# Altium schematic sheet Balance Board.SchDoc
size B
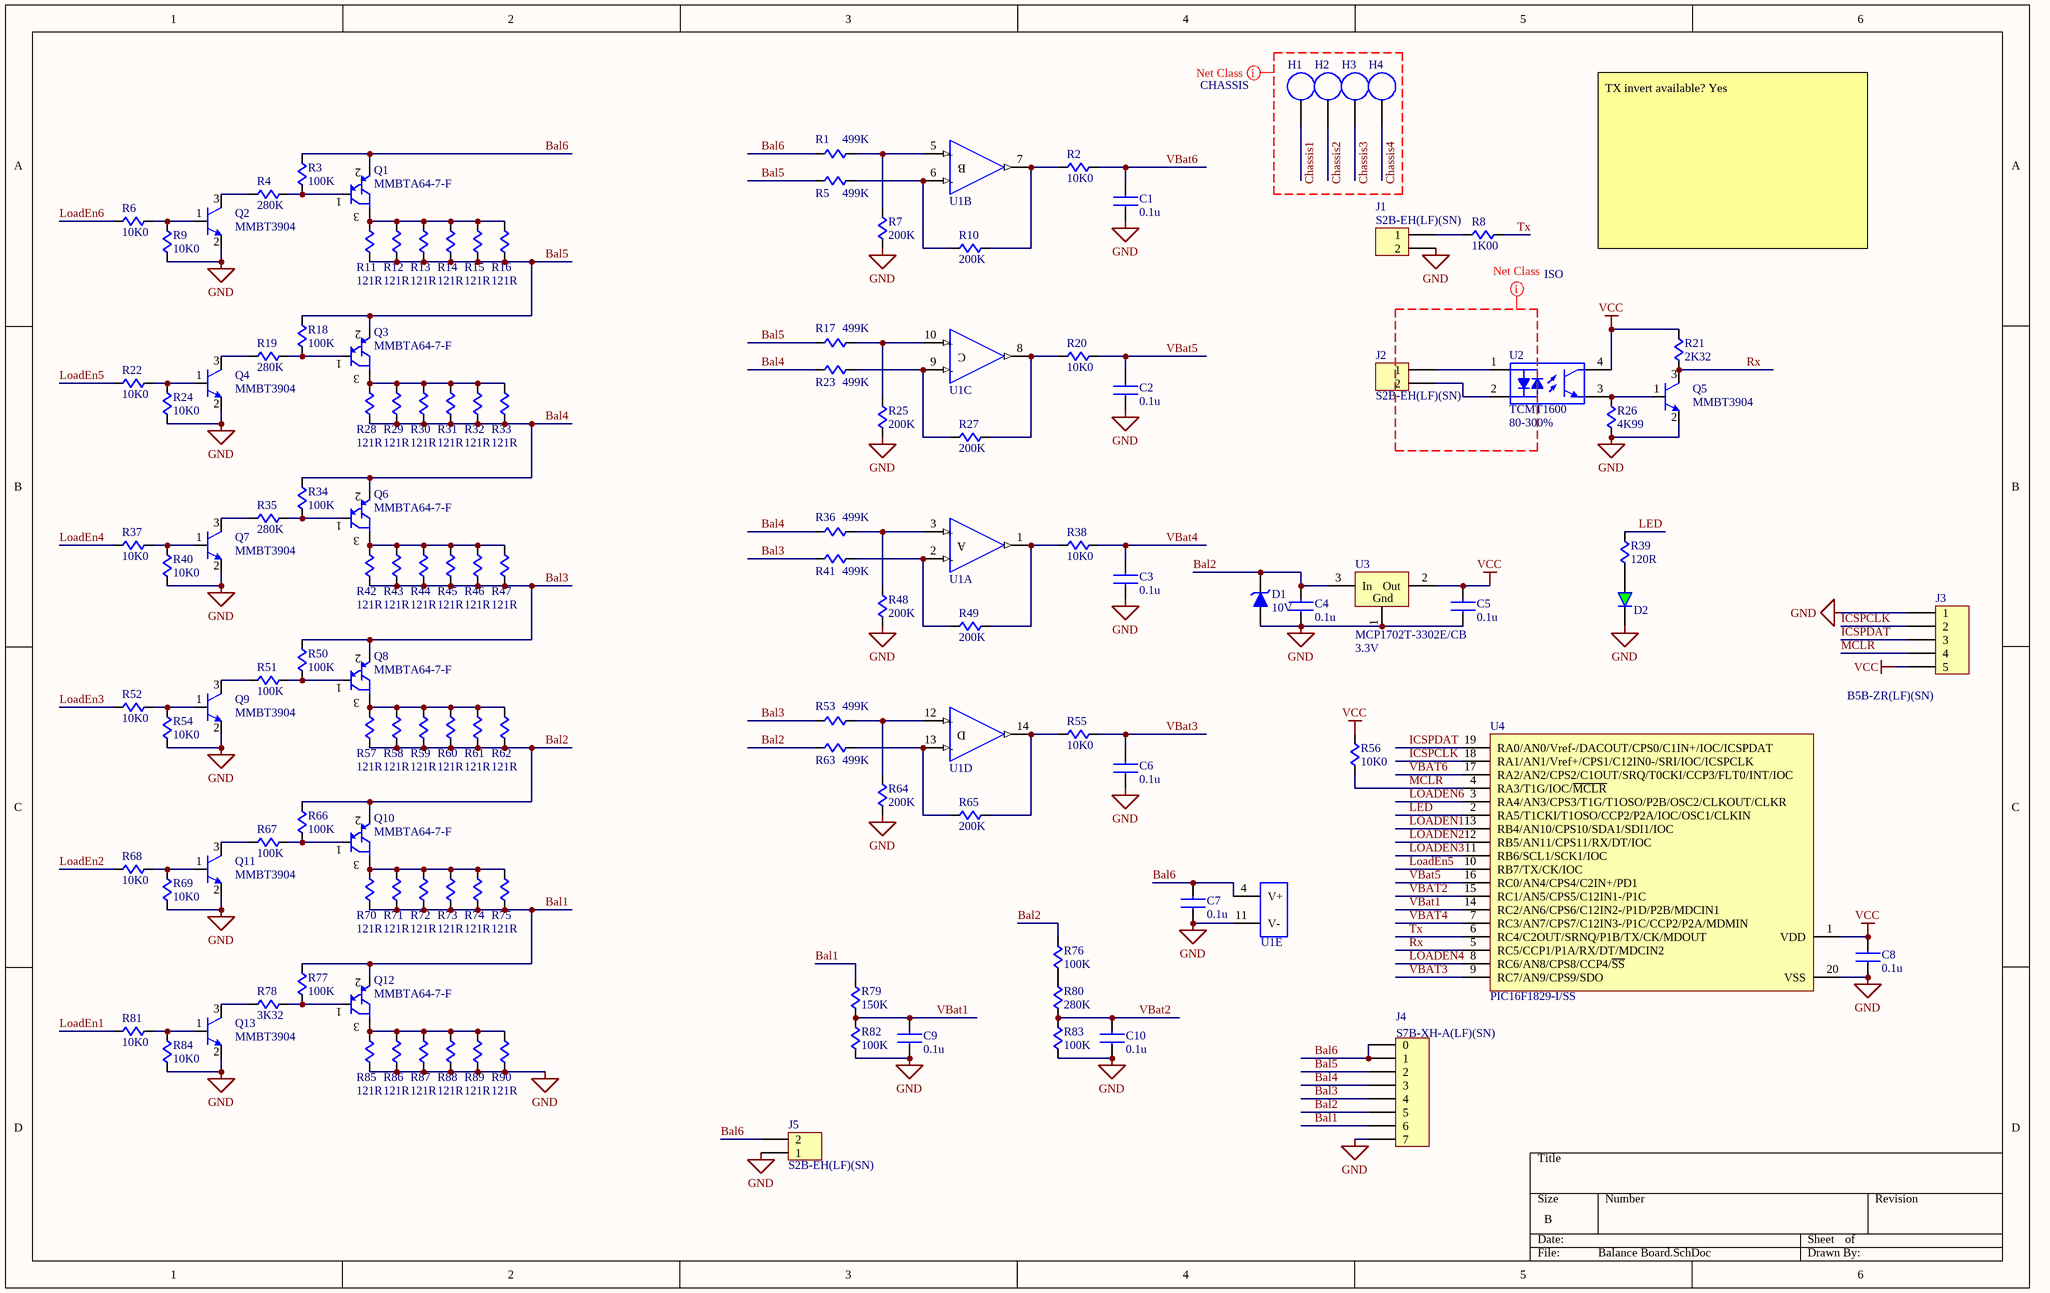
[diagram p0: Balance Board.SchDoc]

## Parts
C1  value 0.1u  [CAPC1608N-0603]  (hidden comment: Cap Ceramic 0.1u 25V X7R 0603)
C2  value 0.1u  [CAPC1608N-0603]  (hidden comment: Cap Ceramic 0.1u 25V X7R 0603)
C3  value 0.1u  [CAPC1608N-0603]  (hidden comment: Cap Ceramic 0.1u 25V X7R 0603)
C4  value 0.1u  [CAPC1608N-0603]  (hidden comment: Cap Ceramic 0.1u 25V X7R 0603)
C5  value 0.1u  [CAPC1608N-0603]  (hidden comment: Cap Ceramic 0.1u 25V X7R 0603)
C6  value 0.1u  [CAPC1608N-0603]  (hidden comment: Cap Ceramic 0.1u 25V X7R 0603)
C7  value 0.1u  [CAPC1608N-0603]  (hidden comment: Cap Ceramic 0.1u 50V X7R 0603)
C8  value 0.1u  [CAPC1608N-0603]  (hidden comment: Cap Ceramic 0.1u 25V X7R 0603)
C9  value 0.1u  [CAPC1608N-0603]  (hidden comment: Cap Ceramic 0.1u 25V X7R 0603)
C10  value 0.1u  [CAPC1608N-0603]  (hidden comment: Cap Ceramic 0.1u 25V X7R 0603)
D1  value 10V  [SOD-123]  (hidden comment: Diode Zener 10V 0.5W SOD-123)
D2  LED Green 160° 0603  [CAPC1608N-0603]  (value not drawn)
H1  Mounting Hole  [HOLE MOUNTING 3MM]  (value not drawn)  (no BOM)
H2  Mounting Hole  [HOLE MOUNTING 3MM]  (value not drawn)  (no BOM)
H3  Mounting Hole  [HOLE MOUNTING 3MM]  (value not drawn)  (no BOM)
H4  Mounting Hole  [HOLE MOUNTING 3MM]  (value not drawn)  (no BOM)
J1  value S2B-EH(LF)(SN)  [S2B-EH]  (hidden comment: Conn Header 2.5mm RA 2-Pos EH)
J2  value S2B-EH(LF)(SN)  [S2B-EH]  (hidden comment: Conn Header 2.5mm RA 2-Pos EH)
J3  value B5B-ZR(LF)(SN)  [B5B-ZR]  (hidden comment: Conn Header 1.5mm Vert 5-Pos ZH)
J4  value S7B-XH-A(LF)(SN)  [S7B-XH&78B-XH-REV]  (hidden comment: Conn Header 2.5mm RA 7-Pos XH)
J5  value S2B-EH(LF)(SN)  [S2B-EH]  (hidden comment: Conn Header 2.5mm RA 2-Pos EH)
Q1  value MMBTA64-7-F  [SOT23-3N]  (hidden comment: Tran PNP Darl 30V 500mA SOT-23)
Q2  value MMBT3904  [SOT23-3N]  (hidden comment: Tran NPN 40V 200mA SOT-23)
Q3  value MMBTA64-7-F  [SOT23-3N]  (hidden comment: Tran PNP Darl 30V 500mA SOT-23)
Q4  value MMBT3904  [SOT23-3N]  (hidden comment: Tran NPN 40V 200mA SOT-23)
Q5  value MMBT3904  [SOT23-3N]  (hidden comment: Tran NPN 40V 200mA SOT-23)
Q6  value MMBTA64-7-F  [SOT23-3N]  (hidden comment: Tran PNP Darl 30V 500mA SOT-23)
Q7  value MMBT3904  [SOT23-3N]  (hidden comment: Tran NPN 40V 200mA SOT-23)
Q8  value MMBTA64-7-F  [SOT23-3N]  (hidden comment: Tran PNP Darl 30V 500mA SOT-23)
Q9  value MMBT3904  [SOT23-3N]  (hidden comment: Tran NPN 40V 200mA SOT-23)
Q10  value MMBTA64-7-F  [SOT23-3N]  (hidden comment: Tran PNP Darl 30V 500mA SOT-23)
Q11  value MMBT3904  [SOT23-3N]  (hidden comment: Tran NPN 40V 200mA SOT-23)
Q12  value MMBTA64-7-F  [SOT23-3N]  (hidden comment: Tran PNP Darl 30V 500mA SOT-23)
Q13  value MMBT3904  [SOT23-3N]  (hidden comment: Tran NPN 40V 200mA SOT-23)
R1  value 499K  [RESC1608N-0603]  (hidden comment: Res 499K 1/10W 1% 0603)
R2  value 10K0  [RESC1608N-0603]  (hidden comment: Res 10.0K 1/10W 1% 0603)
R3  value 100K  [RESC1608N-0603]  (hidden comment: Res 100K 1/10W 1% 0603)
R4  value 280K  [RESC1608N-0603]  (hidden comment: Res 280K 1/10W 1% 0603)
R5  value 499K  [RESC1608N-0603]  (hidden comment: Res 499K 1/10W 1% 0603)
R6  value 10K0  [RESC1608N-0603]  (hidden comment: Res 10.0K 1/10W 1% 0603)
R7  value 200K  [RESC1608N-0603]  (hidden comment: Res 200K 1/10W 1% 0603)
R8  value 1K00  [RESC1608N-0603]  (hidden comment: Res 1.00K 1/10W 1% 0603)
R9  value 10K0  [RESC1608N-0603]  (hidden comment: Res 10.0K 1/10W 1% 0603)
R10  value 200K  [RESC1608N-0603]  (hidden comment: Res 200K 1/10W 1% 0603)
R11  value 121R  [RESC3216N-1206]  (hidden comment: Res 121R 1/4W 1% 1206)
R12  value 121R  [RESC3216N-1206]  (hidden comment: Res 121R 1/4W 1% 1206)
R13  value 121R  [RESC3216N-1206]  (hidden comment: Res 121R 1/4W 1% 1206)
R14  value 121R  [RESC3216N-1206]  (hidden comment: Res 121R 1/4W 1% 1206)
R15  value 121R  [RESC3216N-1206]  (hidden comment: Res 121R 1/4W 1% 1206)
R16  value 121R  [RESC3216N-1206]  (hidden comment: Res 121R 1/4W 1% 1206)
R17  value 499K  [RESC1608N-0603]  (hidden comment: Res 499K 1/10W 1% 0603)
R18  value 100K  [RESC1608N-0603]  (hidden comment: Res 100K 1/10W 1% 0603)
R19  value 280K  [RESC1608N-0603]  (hidden comment: Res 280K 1/10W 1% 0603)
R20  value 10K0  [RESC1608N-0603]  (hidden comment: Res 10.0K 1/10W 1% 0603)
R21  value 2K32  [RESC1608N-0603]  (hidden comment: Res 2.32K 1/10W 1% 0603)
R22  value 10K0  [RESC1608N-0603]  (hidden comment: Res 10.0K 1/10W 1% 0603)
R23  value 499K  [RESC1608N-0603]  (hidden comment: Res 499K 1/10W 1% 0603)
R24  value 10K0  [RESC1608N-0603]  (hidden comment: Res 10.0K 1/10W 1% 0603)
R25  value 200K  [RESC1608N-0603]  (hidden comment: Res 200K 1/10W 1% 0603)
R26  value 4K99  [RESC1608N-0603]  (hidden comment: Res 4.99K 1/10W 1% 0603)
R27  value 200K  [RESC1608N-0603]  (hidden comment: Res 200K 1/10W 1% 0603)
R28  value 121R  [RESC3216N-1206]  (hidden comment: Res 121R 1/4W 1% 1206)
R29  value 121R  [RESC3216N-1206]  (hidden comment: Res 121R 1/4W 1% 1206)
R30  value 121R  [RESC3216N-1206]  (hidden comment: Res 121R 1/4W 1% 1206)
R31  value 121R  [RESC3216N-1206]  (hidden comment: Res 121R 1/4W 1% 1206)
R32  value 121R  [RESC3216N-1206]  (hidden comment: Res 121R 1/4W 1% 1206)
R33  value 121R  [RESC3216N-1206]  (hidden comment: Res 121R 1/4W 1% 1206)
R34  value 100K  [RESC1608N-0603]  (hidden comment: Res 100K 1/10W 1% 0603)
R35  value 280K  [RESC1608N-0603]  (hidden comment: Res 280K 1/10W 1% 0603)
R36  value 499K  [RESC1608N-0603]  (hidden comment: Res 499K 1/10W 1% 0603)
R37  value 10K0  [RESC1608N-0603]  (hidden comment: Res 10.0K 1/10W 1% 0603)
R38  value 10K0  [RESC1608N-0603]  (hidden comment: Res 10.0K 1/10W 1% 0603)
R39  value 120R  [RESC1608N-0603]  (hidden comment: Res 120R 1/10W 1% 0603)
R40  value 10K0  [RESC1608N-0603]  (hidden comment: Res 10.0K 1/10W 1% 0603)
R41  value 499K  [RESC1608N-0603]  (hidden comment: Res 499K 1/10W 1% 0603)
R42  value 121R  [RESC3216N-1206]  (hidden comment: Res 121R 1/4W 1% 1206)
R43  value 121R  [RESC3216N-1206]  (hidden comment: Res 121R 1/4W 1% 1206)
R44  value 121R  [RESC3216N-1206]  (hidden comment: Res 121R 1/4W 1% 1206)
R45  value 121R  [RESC3216N-1206]  (hidden comment: Res 121R 1/4W 1% 1206)
R46  value 121R  [RESC3216N-1206]  (hidden comment: Res 121R 1/4W 1% 1206)
R47  value 121R  [RESC3216N-1206]  (hidden comment: Res 121R 1/4W 1% 1206)
R48  value 200K  [RESC1608N-0603]  (hidden comment: Res 200K 1/10W 1% 0603)
R49  value 200K  [RESC1608N-0603]  (hidden comment: Res 200K 1/10W 1% 0603)
R50  value 100K  [RESC1608N-0603]  (hidden comment: Res 100K 1/10W 1% 0603)
R51  value 100K  [RESC1608N-0603]  (hidden comment: Res 100K 1/10W 1% 0603)
R52  value 10K0  [RESC1608N-0603]  (hidden comment: Res 10.0K 1/10W 1% 0603)
R53  value 499K  [RESC1608N-0603]  (hidden comment: Res 499K 1/10W 1% 0603)
R54  value 10K0  [RESC1608N-0603]  (hidden comment: Res 10.0K 1/10W 1% 0603)
R55  value 10K0  [RESC1608N-0603]  (hidden comment: Res 10.0K 1/10W 1% 0603)
R56  value 10K0  [RESC1608N-0603]  (hidden comment: Res 10.0K 1/10W 1% 0603)
R57  value 121R  [RESC3216N-1206]  (hidden comment: Res 121R 1/4W 1% 1206)
R58  value 121R  [RESC3216N-1206]  (hidden comment: Res 121R 1/4W 1% 1206)
R59  value 121R  [RESC3216N-1206]  (hidden comment: Res 121R 1/4W 1% 1206)
R60  value 121R  [RESC3216N-1206]  (hidden comment: Res 121R 1/4W 1% 1206)
R61  value 121R  [RESC3216N-1206]  (hidden comment: Res 121R 1/4W 1% 1206)
R62  value 121R  [RESC3216N-1206]  (hidden comment: Res 121R 1/4W 1% 1206)
R63  value 499K  [RESC1608N-0603]  (hidden comment: Res 499K 1/10W 1% 0603)
R64  value 200K  [RESC1608N-0603]  (hidden comment: Res 200K 1/10W 1% 0603)
R65  value 200K  [RESC1608N-0603]  (hidden comment: Res 200K 1/10W 1% 0603)
R66  value 100K  [RESC1608N-0603]  (hidden comment: Res 100K 1/10W 1% 0603)
R67  value 100K  [RESC1608N-0603]  (hidden comment: Res 100K 1/10W 1% 0603)
R68  value 10K0  [RESC1608N-0603]  (hidden comment: Res 10.0K 1/10W 1% 0603)
R69  value 10K0  [RESC1608N-0603]  (hidden comment: Res 10.0K 1/10W 1% 0603)
R70  value 121R  [RESC3216N-1206]  (hidden comment: Res 121R 1/4W 1% 1206)
R71  value 121R  [RESC3216N-1206]  (hidden comment: Res 121R 1/4W 1% 1206)
R72  value 121R  [RESC3216N-1206]  (hidden comment: Res 121R 1/4W 1% 1206)
R73  value 121R  [RESC3216N-1206]  (hidden comment: Res 121R 1/4W 1% 1206)
R74  value 121R  [RESC3216N-1206]  (hidden comment: Res 121R 1/4W 1% 1206)
R75  value 121R  [RESC3216N-1206]  (hidden comment: Res 121R 1/4W 1% 1206)
R76  value 100K  [RESC1608N-0603]  (hidden comment: Res 100K 1/10W 1% 0603)
R77  value 100K  [RESC1608N-0603]  (hidden comment: Res 100K 1/10W 1% 0603)
R78  value 3K32  [RESC1608N-0603]  (hidden comment: Res 3.32K 1/10W 1% 0603)
R79  value 150K  [RESC1608N-0603]  (hidden comment: Res 150K 1/10W 1% 0603)
R80  value 280K  [RESC1608N-0603]  (hidden comment: Res 280K 1/10W 1% 0603)
R81  value 10K0  [RESC1608N-0603]  (hidden comment: Res 10.0K 1/10W 1% 0603)
R82  value 100K  [RESC1608N-0603]  (hidden comment: Res 100K 1/10W 1% 0603)
R83  value 100K  [RESC1608N-0603]  (hidden comment: Res 100K 1/10W 1% 0603)
R84  value 10K0  [RESC1608N-0603]  (hidden comment: Res 10.0K 1/10W 1% 0603)
R85  value 121R  [RESC3216N-1206]  (hidden comment: Res 121R 1/4W 1% 1206)
R86  value 121R  [RESC3216N-1206]  (hidden comment: Res 121R 1/4W 1% 1206)
R87  value 121R  [RESC3216N-1206]  (hidden comment: Res 121R 1/4W 1% 1206)
R88  value 121R  [RESC3216N-1206]  (hidden comment: Res 121R 1/4W 1% 1206)
R89  value 121R  [RESC3216N-1206]  (hidden comment: Res 121R 1/4W 1% 1206)
R90  value 121R  [RESC3216N-1206]  (hidden comment: Res 121R 1/4W 1% 1206)
U1  IC Op-Amp Low Power RRIO 32V 14-SOIC  [SOIC127P600-14N]  (value not drawn)  (parts A,B,C,D,E of 5)
U2  value 80-300%  [MFP127P4.4-4]  (hidden comment: IC Optocoupler Bi-Di LED 80-300% SOIC4)
U3  value 3.3V  [SOT23-3N]  (hidden comment: IC Voltage Reg LDO 3.3V SOT-23)
U4  value PIC16F1829-I/SS  [SOP65P780X200-20N]  (hidden comment: IC Micro PIC16F1829 20-SSOP)

## Nets
GND: C1.2 C2.2 C3.2 C4.2 C5.2 C6.2 C7.2 C8.2 C9.2 C10.2 D1.2(Anode) D2.1(Cathode) J1.2 J3.1 J4.7 J5.1 Q2.2(E) Q4.2(E) Q5.2(E) Q7.2(E) Q9.2(E) Q11.2(E) Q13.2(E) R7.1 R9.1 R24.1 R25.1 R26.1 R40.1 R48.1 R54.1 R64.1 R69.1 R82.1 R83.1 R84.1 R85.1 R86.1 R87.1 R88.1 R89.1 R90.1 U1.11(V-) U3.1(Gnd) U4.20(VSS)
VCC: C5.1 C8.1 J3.5 R21.2 R56.2 U2.4(Collector) U3.2(Out) U4.1(VDD)
Bal1: J4.6 Q12.2(Emitter) R70.1 R71.1 R72.1 R73.1 R74.1 R75.1 R77.2 R79.2
Bal2: C4.1 D1.1(Cathode) J4.5 Q10.2(Emitter) R57.1 R58.1 R59.1 R60.1 R61.1 R62.1 R63.1 R66.2 R76.2 U3.3(In)
Bal3: J4.4 Q8.2(Emitter) R41.1 R42.1 R43.1 R44.1 R45.1 R46.1 R47.1 R50.2 R53.1
Bal4: J4.3 Q6.2(Emitter) R23.1 R28.1 R29.1 R30.1 R31.1 R32.1 R33.1 R34.2 R36.1
Bal5: J4.2 Q3.2(Emitter) R5.1 R11.1 R12.1 R13.1 R14.1 R15.1 R16.1 R17.1 R18.2
Bal6: C7.1 J4.0 J4.1 J5.2 Q1.2(Emitter) R1.1 R3.2 U1.4(V+)
Chassis1: H1.1
Chassis2: H2.1
Chassis3: H3.1
Chassis4: H4.1
ICSPCLK: J3.2 U4.18(RA1/AN1/Vref+/CPS1/C12IN0-/SRI/IOC/ICSPCLK)
ICSPDAT: J3.3 U4.19(RA0/AN0/Vref-/DACOUT/CPS0/C1IN+/IOC/ICSPDAT)
LED: R39.2 U4.2(RA5/T1CKI/T1OSO/CCP2/P2A/IOC/OSC1/CLKIN)
LoadEn1: R81.2 U4.13(RB4/AN10/CPS10/SDA1/SDI1/IOC)
LoadEn2: R68.2 U4.12(RB5/AN11/CPS11/RX/DT/IOC)
LoadEn3: R52.2 U4.11(RB6/SCL1/SCK1/IOC)
LoadEn4: R37.2 U4.8(RC6/AN8/CPS8/CCP4/~{SS})
LoadEn5: R22.2 U4.10(RB7/TX/CK/IOC)
LoadEn6: R6.2 U4.3(RA4/AN3/CPS3/T1G/T1OSO/P2B/OSC2/CLKOUT/CLKR)
~{MCLR}: J3.4 R56.1 U4.4(RA3/T1G/IOC/~{MCLR})
Rx: Q5.3(C) R21.1 U4.5(RC5/CCP1/P1A/RX/DT/MDCIN2)
Tx: R8.2 U4.6(RC4/C2OUT/SRNQ/P1B/TX/CK/MDOUT)
VBat1: C9.1 R79.1 R82.2 U4.14(RC2/AN6/CPS6/C12IN2-/P1D/P2B/MDCIN1)
VBat2: C10.1 R80.1 R83.2 U4.15(RC1/AN5/CPS5/C12IN1-/P1C)
VBat3: C6.1 R55.2 U4.9(RC7/AN9/CPS9/SDO)
VBat4: C3.1 R38.2 U4.7(RC3/AN7/CPS7/C12IN3-/P1C/CCP2/P2A/MDMIN)
VBat5: C2.1 R20.2 U4.16(RC0/AN4/CPS4/C2IN+/PD1)
VBat6: C1.1 R2.2 U4.17(RA2/AN2/CPS2/C1OUT/SRQ/T0CKI/CCP3/FLT0/INT/IOC)
NetD2_2: D2.2(Anode) R39.1
NetJ1_1: J1.1 R8.1
NetJ2_1: J2.1 U2.1(Anode)
NetJ2_2: J2.2 U2.2(Cathode)
NetQ1_1: Q1.1(Base) R3.1 R4.1
NetQ1_3: Q1.3(Collector) R11.2 R12.2 R13.2 R14.2 R15.2 R16.2
NetQ2_1: Q2.1(B) R6.1 R9.2
NetQ2_3: Q2.3(C) R4.2
NetQ3_1: Q3.1(Base) R18.1 R19.1
NetQ3_3: Q3.3(Collector) R28.2 R29.2 R30.2 R31.2 R32.2 R33.2
NetQ4_1: Q4.1(B) R22.1 R24.2
NetQ4_3: Q4.3(C) R19.2
NetQ5_1: Q5.1(B) R26.2 U2.3(Emitter)
NetQ6_1: Q6.1(Base) R34.1 R35.1
NetQ6_3: Q6.3(Collector) R42.2 R43.2 R44.2 R45.2 R46.2 R47.2
NetQ7_1: Q7.1(B) R37.1 R40.2
NetQ7_3: Q7.3(C) R35.2
NetQ8_1: Q8.1(Base) R50.1 R51.1
NetQ8_3: Q8.3(Collector) R57.2 R58.2 R59.2 R60.2 R61.2 R62.2
NetQ9_1: Q9.1(B) R52.1 R54.2
NetQ9_3: Q9.3(C) R51.2
NetQ10_1: Q10.1(Base) R66.1 R67.1
NetQ10_3: Q10.3(Collector) R70.2 R71.2 R72.2 R73.2 R74.2 R75.2
NetQ11_1: Q11.1(B) R68.1 R69.2
NetQ11_3: Q11.3(C) R67.2
NetQ12_1: Q12.1(Base) R77.1 R78.1
NetQ12_3: Q12.3(Collector) R85.2 R86.2 R87.2 R88.2 R89.2 R90.2
NetQ13_1: Q13.1(B) R81.1 R84.2
NetQ13_3: Q13.3(C) R78.2
NetR1_2: R1.2 R7.2 U1.5(+B)
NetR2_1: R2.1 R10.2 U1.7(Output_A)
NetR5_2: R5.2 R10.1 U1.6(-B)
NetR17_2: R17.2 R25.2 U1.10(+C)
NetR20_1: R20.1 R27.2 U1.8(Output_A)
NetR23_2: R23.2 R27.1 U1.9(-C)
NetR36_2: R36.2 R48.2 U1.3(+A)
NetR38_1: R38.1 R49.2 U1.1(Output_A)
NetR41_2: R41.2 R49.1 U1.2(-A)
NetR53_2: R53.2 R64.2 U1.12(+D)
NetR55_1: R55.1 R65.2 U1.14(Output_A)
NetR63_2: R63.2 R65.1 U1.13(-D)
NetR76_1: R76.1 R80.2

## Layout directives
net class ISO: (no net found under the mark)
net class CHASSIS: Chassis1, Chassis2, Chassis3, Chassis4

## Notes on the sheet
- TX invert available? Yes
- (in symbol LP324DR, part A) +; A; -
- (in symbol LP324DR, part B) +; B; -
- (in symbol LP324DR, part C) +; C; -
- (in symbol LP324DR, part D) +; D; -

## Library data of the parts
C1-C6 C8-C10 = C0603C104K3RACTU: Dist: Digi-Key; Dist P/N: 399-1281-1-ND; Mfg: Kemet; Mfgr P/N: C0603C104K3RACTU; Price: 0.079
C7 = CC0603KRX7R9BB104: Dist: Digi-Key; Dist P/N: 311-1344-1-ND; Mfg: Yageo; Mfgr P/N: CC0603KRX7R9BB104; Price: 0.35
D1 = BZT52C10-TP: Dist: Digi-Key; Dist P/N: BZT52C10-TPMSCT-ND; Mfg: MCC; Mfgr P/N: BZT52C10-TP; Price: 0.38; Datasheet: http://61.222.192.61/mccsemi/up_pdf/MMSZ5221-MMSZ5259(SOD123).pdf
D2 = LG Q971-KN-1: Dist: Digi-Key; Dist P/N: 475-1409-1-ND; Mfg: Osram; Price: 0.11; HelpURL: http://catalog.osram-os.com/catalogue/catalogue.do;jsessionid=60BD7AD44689CBF6EBE1906F01C7D3CB?act=downloadFile&favOid=0200000300015082000200b6; Mfgr P/N: LG Q971-KN-1; Value: LG Q971-KN-1
H1-H4 = Hole Mounting
J1 J2 J5 = S2B-EH(LF)(SN): Dist: Digi-Key; Dist P/N: 455-1625-ND; Mfg: JST; Mfgr P/N: S2B-EH(LF)(SN); Price: 0.16; HelpURL: http://www.jst-mfg.com/product/pdf/eng/eEH.pdf
J3 = B5B-ZR(LF)(SN): Dist: Digi-Key; Dist P/N: 455-1660-ND; Mfg: JST; Mfgr P/N: B5B-ZR(LF)(SN); Price: 0.2; HelpURL: http://www.jst-mfg.com/product/pdf/eng/eZH.pdf
J4 = S8B-XH-A(LF)(SN)_CUST: Dist: Digi-Key; Dist P/N: 455-2240-ND; Mfg: JST; Mfgr P/N: S7B-XH-A(LF)(SN); Price: 0.43; HelpURL: http://www.jst-mfg.com/product/pdf/eng/eXH.pdf
Q1 Q3 Q6 Q8 Q10 Q12 = MMBTA64-7-F: Dist: Digi-Key; Dist P/N: MMBTA64-FDICT-ND; Mfg: Diodes Inc; Mfgr P/N: MMBTA64-7-F; Price: 0.27; HelpURL: http://www.diodes.com/datasheets/ds30055.pdf
Q2 Q4 Q5 Q7 Q9 Q11 Q13 = MMBT3904: Dist: Digi-Key; Dist P/N: MMBT3904FSCT-ND; Mfg: Fairchild; Mfgr P/N: MMBT3904; Price: 0.37; Datasheet: http://www.fairchildsemi.com/ds/MM/MMBT3904.pdf
R1 R5 R17 R23 R36 R41 R53 R63 = ERJ-3EKF4993V: Dist: Digi-Key; Dist P/N: P499KHCT-ND; Mfg: Panasonic; Mfgr P/N: ERJ-3EKF4993V; Price: 0.05
R2 R6 R9 R20 R22 R24 R37 R38 R40 R52 R54-R56 R68 R69 R81 R84 = ERJ-3EKF1002V: Dist: Digi-Key; Dist P/N: P10.0KHCT-ND; Mfg: Panasonic; Mfgr P/N: ERJ-3EKF1002V; Price: 0.05
R3 R18 R34 R50 R51 R66 R67 R76 R77 R82 R83 = ERJ-3EKF1003V: Dist: Digi-Key; Dist P/N: P100KHCT-ND; Mfg: Panasonic; Mfgr P/N: ERJ-3EKF1003V; Price: 0.05
R4 R19 R35 R80 = ERJ-3EKF2803V: Dist: Digi-Key; Dist P/N: P280KHCT-ND; Mfg: Panasonic; Mfgr P/N: ERJ-3EKF2803V; Price: 0.05
R7 R10 R25 R27 R48 R49 R64 R65 = ERJ-3EKF2003V: Dist: Digi-Key; Dist P/N: P200KHCT-ND; Mfg: Panasonic; Mfgr P/N: ERJ-3EKF2003V; Price: 0.05
R8 = ERJ-3EKF1001V: Dist: Digi-Key; Dist P/N: P1.00KHCT-ND; Mfg: Panasonic; Mfgr P/N: ERJ-3EKF1001V; Price: 0.05
R11-R16 R28-R33 R42-R47 R57-R62 R70-R75 R85-R90 = ERJ-8ENF1210V: Dist: Digi-Key; Dist P/N: P121FCT-ND; Mfg: Panasonic; Mfgr P/N: ERJ-8ENF1210V; Price: 0.10; HelpURL: http://industrial.panasonic.com/www-cgi/jvcr13pz.cgi?E+PZ+3+AOA0002+ERJ8ENF22R1V+7+WW
R21 = ERJ-3EKF2321V: Dist: Digi-Key; Dist P/N: P2.32KHCT-ND; Mfg: Panasonic; Mfgr P/N: ERJ-3EKF2321V; Price: 0.05
R26 = ERJ-3EKF4991V: Dist: Digi-Key; Dist P/N: P4.99KHCT-ND; Mfg: Panasonic; Mfgr P/N: ERJ-3EKF4991V; Price: 0.05
R39 = ERJ-3EKF1200V: Dist: Digi-Key; Dist P/N: P120HCT-ND; Mfg: Panasonic; Mfgr P/N: ERJ-3EKF1200V; Price: 0.05
R78 = ERJ-3EKF3322V: Dist: Digi-Key; Dist P/N: P3.32KHCT-ND; Mfg: Panasonic; Mfgr P/N: ERJ-3EKF3322V; Price: 0.05
R79 = ERJ-3EKF1503V_1: Dist: Digi-Key; Dist P/N: P150KHCT-ND; Mfg: Panasonic; Mfgr P/N: ERJ-3EKF1503V; Price: 0.05
U1 = LP324DR: Dist: Digi-Key; Dist P/N: 296-17953-1-ND; Mfg: TI; HelpURL: http://www.ti.com/lit/ds/symlink/lp2902.pdf; Price: 0.62; Value: LP324DR; Mfgr P/N: LP324DR
U2 = TCMT1600: Dist P/N: 751-1374-1-ND; Dist: Digikey; Mfg: Vishay; HelpURL: http://www.vishay.com/doc?83512; Price: 0.73; Mfgr P/N: TCMT1600
U3 = MCP1702T-3302E/CB: Dist: Digi-Key; Dist P/N: MCP1702T-3302E/CBCT-ND; Mfg: Microchip; Price: 0.59; HelpURL: http://ww1.microchip.com/downloads/en/DeviceDoc/22008E.pdf; Mfgr P/N: MCP1702T-3302E/CB
U4 = PIC16F1828-I/SS: Dist: Digi-Key; Dist P/N: PIC16F1829-I/SS-ND; Mfg: Microchip; Mfgr P/N: PIC16F1829-I/SS; Price: 1.74; HelpURL: http://ww1.microchip.com/downloads/en/DeviceDoc/41419D.pdf